# EAGLE design working (EAGLE 9.6.2)
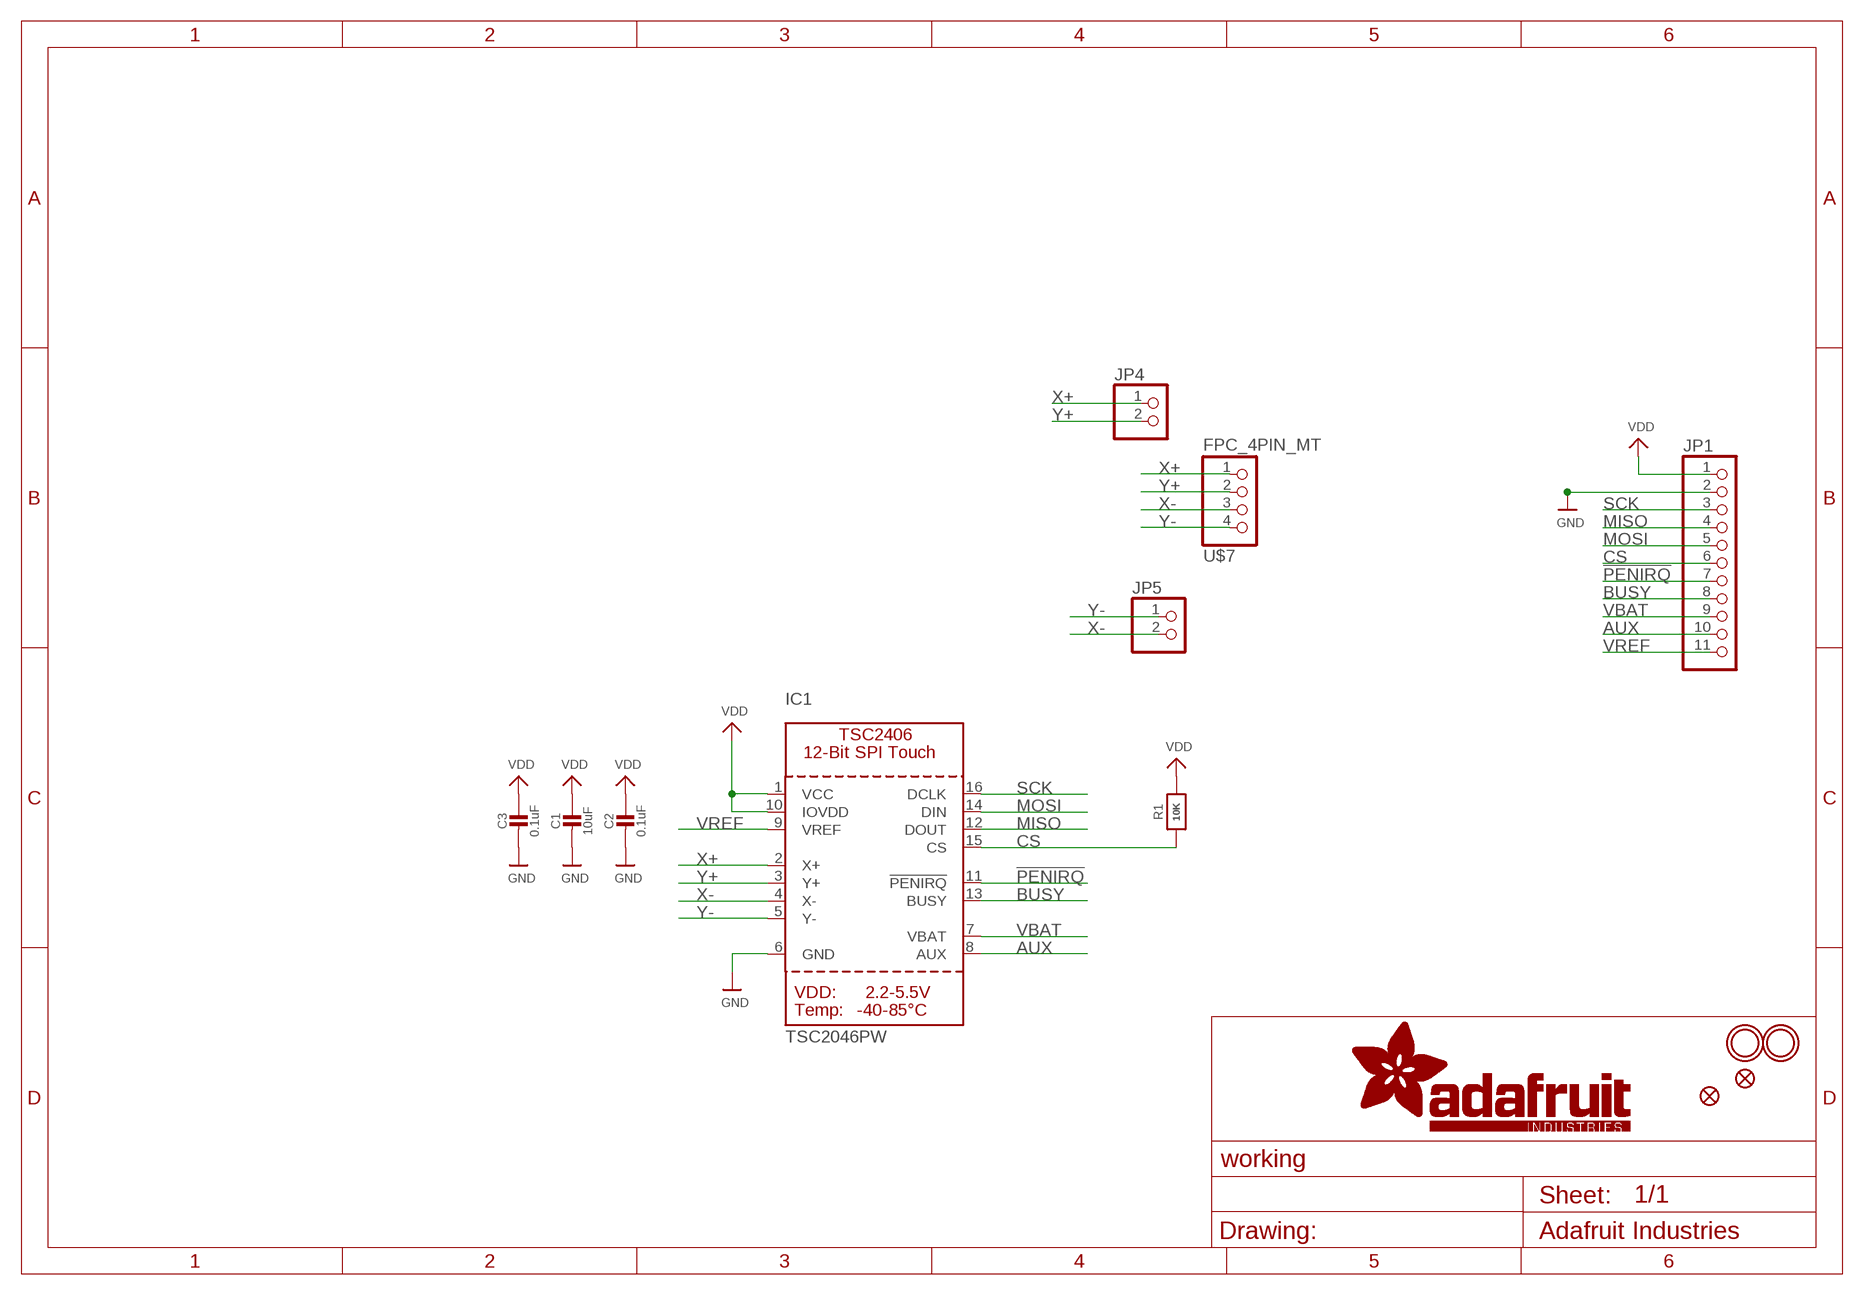
[diagram p0: schematic, sheet 1]

## Parts
C1  10uF  CAP_CERAMIC0805-NOOUTLINE  [0805-NO]
C2  0.1uF  CAP_CERAMIC0603_NO  [0603-NO]
C3  0.1uF  CAP_CERAMIC0603_NO  [0603-NO]
FID2  FIDUCIAL_1MM  [FIDUCIAL_1MM]
FID3  FIDUCIAL_1MM  [FIDUCIAL_1MM]
IC1  TSC2046PW  [TSSOP16]
JP1  HEADER-1X11  [1X11_ROUND]
JP4  HEADER-1X2ROUND  [1X02_ROUND]
JP5  HEADER-1X2ROUND  [1X02_ROUND]
R1  10K  RESISTOR_0603_NOOUT  [0603-NO]
U$4  MOUNTINGHOLE2.5  [MOUNTINGHOLE_2.5_PLATED]
U$5  MOUNTINGHOLE2.5  [MOUNTINGHOLE_2.5_PLATED]
U$7  FPC_4PIN_MT  [FPC_CONN_1MM_DUAL_4P_MT]

## Nets
!PENIRQ: IC1.11(!PENIRQ) JP1.7
AUX: IC1.8(AUX) JP1.10
BUSY: IC1.13(BUSY) JP1.8
CS: IC1.15(CS) JP1.6 R1.1
GND: C1.2 C2.2 C3.2 IC1.6(GND) JP1.2
MISO: IC1.12(DOUT) JP1.4
MOSI: IC1.14(DIN) JP1.5
SCK: IC1.16(DCLK) JP1.3
VBAT: IC1.7(VBAT) JP1.9
VDD: C1.1 C2.1 C3.1 IC1.1(VCC) IC1.10(IOVDD) JP1.1 R1.2
VREF: IC1.9(VREF) JP1.11
X+: IC1.2(X+) JP4.1 U$7.1
X-: IC1.4(X-) JP5.2 U$7.3
Y+: IC1.3(Y+) JP4.2 U$7.2
Y-: IC1.5(Y-) JP5.1 U$7.4

## Library data of the parts
C1-C3 = microbuilder:CAP_CERAMIC: Ceramic Capacitors For new designs, use the packages preceded by an '_' character since they are more reliable: The following footprints should be used on most boards: _0402 - Standard footprint for regular board layouts _0603 - Standard footprint for regular board layouts _0805 - Standard footprint for regular board layouts _1206 - Standard footprint for regular board layouts For extremely tight-pitch boards where space is at a premium, the following 'micro-pitch' footprints can be used (smaller pads, no silkscreen outline, etc.): _0402MP - Micro-pitch footprint for very dense/compact boards _0603MP - Micro-pitch footprint for very dense/compact boards _0805MP - Micro-pitch footprint for very dense/compact boards _1206MP - Micro-pitch footprint for very dense/compact boards
FID2 FID3 = microbuilder:FIDUCIAL: Fiducial Alignment Points Various fiducial points for machine vision alignment.; BOM: EXCLUDE
IC1 = adafruit_sensor:TSC2046
JP1 = microbuilder:HEADER-1X11
JP4 JP5 = microbuilder:HEADER-1X2: PIN HEADER
R1 = microbuilder:RESISTOR: Resistors For new designs, use the packages preceded by an '_' character since they are more reliable: The following footprints should be used on most boards: _0402 - Standard footprint for regular board layouts _0603 - Standard footprint for regular board layouts _0805 - Standard footprint for regular board layouts _1206 - Standard footprint for regular board layouts For extremely tight-pitch boards where space is at a premium, the following 'micro-pitch' footprints can be used (smaller pads, no silkscreen outline, etc.): _0402MP - Micro-pitch footprint for very dense/compact boards _0603MP - Micro-pitch footprint for very dense/compact boards _0805MP - Micro-pitch footprint for very dense/compact boards _1206MP - Micro-pitch footprint for very dense/compact boards
U$4 U$5 = adafruit_electromech:MOUNTINGHOLE: Mounting Hole For #2 screws (0.086"/2.18mm width, 0.094"/2.4mm hole) use 2.5mm; BOM: EXCLUDE
U$7 = adafruit_electromech:FPC_4PIN

## Board
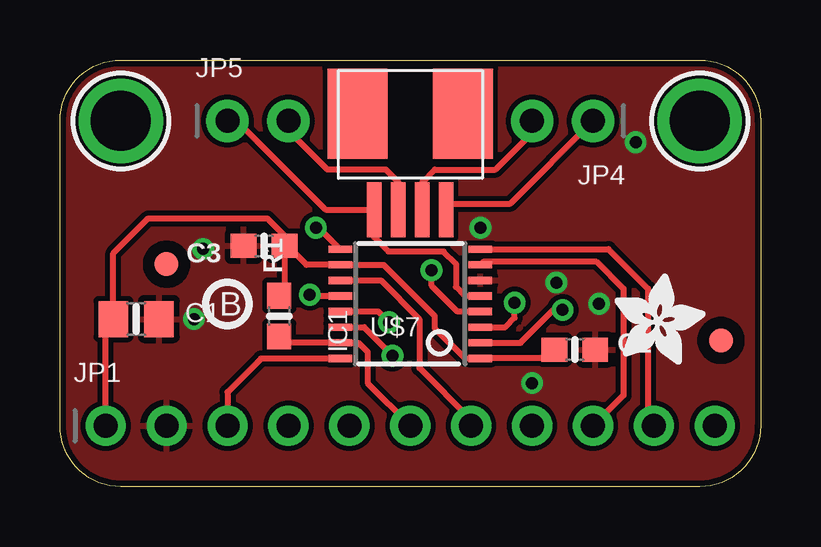
[diagram p1: board, top side]
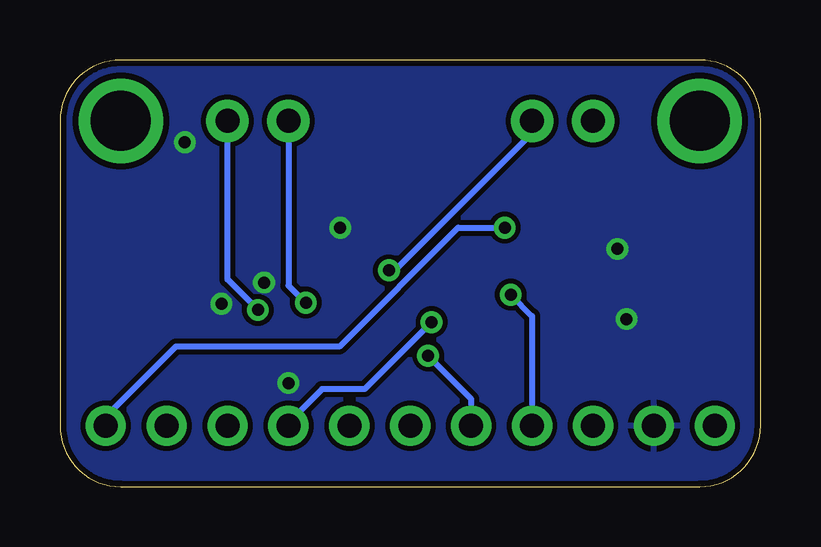
[diagram p2: board, bottom side, seen from below]

Size 29.21 x 17.78 mm. Coordinates in mm from the lower left corner, seen from the top.
Outline: 29.21,15.24 29.21,2.54 arc-90 26.67,0 2.54,0 arc-90 0,2.54 0,15.24 arc-90 2.54,17.78 26.67,17.78 arc-90 29.21,15.24
Copper layers (1*16): Top 0.035mm / dielectric 1.5mm / Bottom 0.035mm
Design rules "adafruit *": minimum track width 8mil, minimum drill 15.5mil, track to track 8mil, track to pad 8mil, pad to pad 8mil, via to via 8mil, smd to smd 8mil, copper to edge 10mil, drill to drill 8mil, minimum pad ring 10mil, minimum via ring 8mil, stop-mask expansion 4mil, vias tented up to drill 20mil, thermal gap 10mil

### Footprints (pad centres in the part's own frame; a part is rotated, then mirrored left to right if it is on the bottom)
0805-NO = smd 1.24 x 1.5: 1 -0.95,0; 2 0.95,0
0603-NO = smd 1.075 x 1: 1 -0.85,0; 2 0.85,0
FIDUCIAL_1MM = smd 1 x 1: 1 0,0
TSSOP16 = smd 0.305 x 0.991: 1 -2.275,-2.918; 2 -1.625,-2.918; 3 -0.975,-2.918; 4 -0.325,-2.918; 5 0.325,-2.918; 6 0.975,-2.918; 7 1.625,-2.918; 8 2.275,-2.918; 9 2.275,2.918; 10 1.625,2.918; 11 0.975,2.918; 12 0.325,2.918; 13 -0.325,2.918; 14 -0.975,2.918; 15 -1.625,2.918; 16 -2.275,2.918
1X11_ROUND = drill 1 pad 1.676: 1 -12.7,0; 2 -10.16,0; 3 -7.62,0; 4 -5.08,0; 5 -2.54,0; 6 0,0; 7 2.54,0; 8 5.08,0; 9 7.62,0; 10 10.16,0; 11 12.7,0
1X02_ROUND = drill 1 pad 1.778: 1 -1.27,0; 2 1.27,0
MOUNTINGHOLE_2.5_PLATED = drill 2.5 pad 3.2: P$1 0,0
FPC_CONN_1MM_DUAL_4P_MT = smd 0.6 x 2.3: 1 -1.5,2.3; 2 -0.5,2.3; 3 0.5,2.3; 4 1.5,2.3 | smd 2.5 x 3.75: MT1 2.2,-1.7; MT2 -2.2,-1.7

### Placement (x,y rotation side)
C1  3.17,6.99 0 top
C2  21.46,5.71 0 top
C3  8.51,10.03 180 top
FID2  27.56,6.1 0 top
FID3  4.45,9.27 0 top
IC1  14.61,7.62 90 top
JP1  14.61,2.54 0 top
JP4  20.95,15.24 180 top
JP5  8.26,15.24 0 top
PLABEL0  [PLABEL0]  6.99,16.89 0 top
PLABEL1  [PLABEL1]  22.48,16.89 0 top
PLABEL2  [PLABEL2]  19.81,16.89 0 top
PLABEL3  [PLABEL3]  9.78,16.89 0 top
PLABEL4  [PLABEL4]  1.91,4.32 0 top
PLABEL5  [PLABEL5]  4.57,0.76 0 top
PLABEL6  [PLABEL6]  7.11,4.19 0 top
PLABEL7  [PLABEL7]  14.48,0.76 0 top
PLABEL8  [PLABEL8]  17.4,4.19 0 top
PLABEL9  [PLABEL9]  5.46,12.06 0 top
PLABEL10  [PLABEL10]  22.35,11.56 0 top
PLABEL11  [PLABEL11]  19.81,0.76 0 top
PLABEL12  [PLABEL12]  27.3,4.32 0 top
PLABEL13  [PLABEL13]  22.23,4.32 0 top
PLABEL14  [PLABEL14]  24.89,0.76 0 top
PLABEL15  [PLABEL15]  12.19,4.19 0 top
PLABEL16  [PLABEL16]  9.53,0.76 0 top
PLABEL17  [PLABEL17]  14.73,12.95 0 bottom
PLABEL18  [PLABEL18]  14.35,8.89 0 bottom
R1  9.14,7.11 90 top
U$4  2.54,15.24 0 top
U$5  26.67,15.24 0 top
U$6  [PCBFEAT-REV-040]  6.99,7.62 0 top
U$7  14.61,13.84 180 top
U$8  [ADAFRUIT_3.5MM]  23.11,5.08 0 top

### Tracks (layer width: path | path; a pad name or v marks a point on that pad's centre or on a via)
!PENIRQ
  Top 0.254: IC1.11 13.38,8.6 14.99,6.99 14.99,4.95 17.14,2.79 JP1.7
AUX
  Top 0.254: IC1.8 22.87,9.89 24.51,8.26 24.51,2.79 JP1.10
BUSY  (via drill 0.5)
  Top 0.254: 13.28,7.29 IC1.13 | v13.72,6.86 13.28,7.29 | 13.28,7.29
  Bottom 0.254: v13.72,6.86 16.51,4.06 18.29,4.06 19.68,2.67 JP1.8
CS
  Top 0.254: R1.1 9.41,6 IC1.15 12.45,6 12.83,5.61 12.83,4.32 JP1.6
GND  (via drill 0.5)
  other vias: 5.97,9.91 5.59,6.99 20.7,8.51 17.53,10.79 24,14.35 22.48,7.62 19.68,4.32
  pour Top: 0,17.78 29.21,17.78 29.21,0 0,0
  pour Bottom: 0,17.78 29.21,17.78 29.21,0 0,0
MISO  (via drill 0.5)
  Top 0.254: IC1.12 10.47,7.95 v10.41,8
  Bottom 0.254: v10.41,8 9.53,7.11 JP1.4
MOSI  (via drill 0.5)
  Top 0.254: v13.86,5.46 12.68,6.64 IC1.14
  Bottom 0.254: v13.86,5.46 12.06,3.66 JP1.5
SCK
  Top 0.254: IC1.16 11.68,5.33 8.38,5.33 6.99,3.94 JP1.3
VBAT
  Top 0.254: IC1.7 17.65,9.37 22.38,9.37 23.5,8.26 23.5,3.81 JP1.9
VDD
  Top 0.254: JP1.1 1.91,6.67 C1.1 2.23,9.72 3.68,11.18 8.64,11.18 9.36,10.45 9.36,10.16 | 9.36,10.16 C3.1 9.36,8.18 R1.2 | 9.36,10.16 10.27,9.24 IC1.10 13.5,9.24 15.62,7.12 15.62,6.6 16.88,5.34 IC1.1 20.24,5.34 C2.1
VREF  (via drill 0.5)
  Top 0.254: v10.67,10.79 10.79,10.79 IC1.9
  Bottom 0.254: v10.67,10.79 12.61,10.79 17.56,5.84 24.38,5.84 27.3,2.92 JP1.11
X+  (via drill 0.5)
  Top 0.254: U$7.1 16.36,11.8 18.78,11.8 JP4.1 | IC1.2 19.2,6 20.57,7.37 v20.95,7.37
  Bottom 0.254: JP4.1 22.23,8.64 v20.95,7.37
X-  (via drill 0.5)
  Top 0.254: IC1.4 16.58,7.29 15.49,8.38 v15.49,9.02 | U$7.3 14.11,12.69 13.59,13.21 11.15,13.21 9.53,14.83 JP5.2
  Bottom 0.254: v15.49,9.02 15.24,9.02 9.53,14.73 JP5.2
Y+  (via drill 0.5)
  Top 0.254: IC1.3 18.57,6.64 18.96,7.03 v18.96,7.67 | U$7.2 15.11,12.69 15.62,13.21 18.16,13.21 19.68,14.73 JP4.2
  Bottom 0.254: JP4.2 19.68,8.38 v18.97,7.67 v18.96,7.67
Y-
  Top 0.254: JP5.1 7.37,15.24 11.06,11.54 U$7.4 13.11,10.39 13.7,9.8 16,9.8 16.51,9.29 16.51,8.33 16.89,7.95 IC1.5

### Text on the board
Pinguin_tBackup: Y- | X- | Y+ | X+ | TSC2046 | Resistive / Touchscreen / Controller | Vin | SCK | MOSI | IRQ | Vbat | VRef | GND | MISO | CS | BUSY | AUX
Pinguin_bBackup: TSC2046 | Resistive Touch Screen / Controller w/ SPI Interface / Vin/Vlogic: 3-5VDC